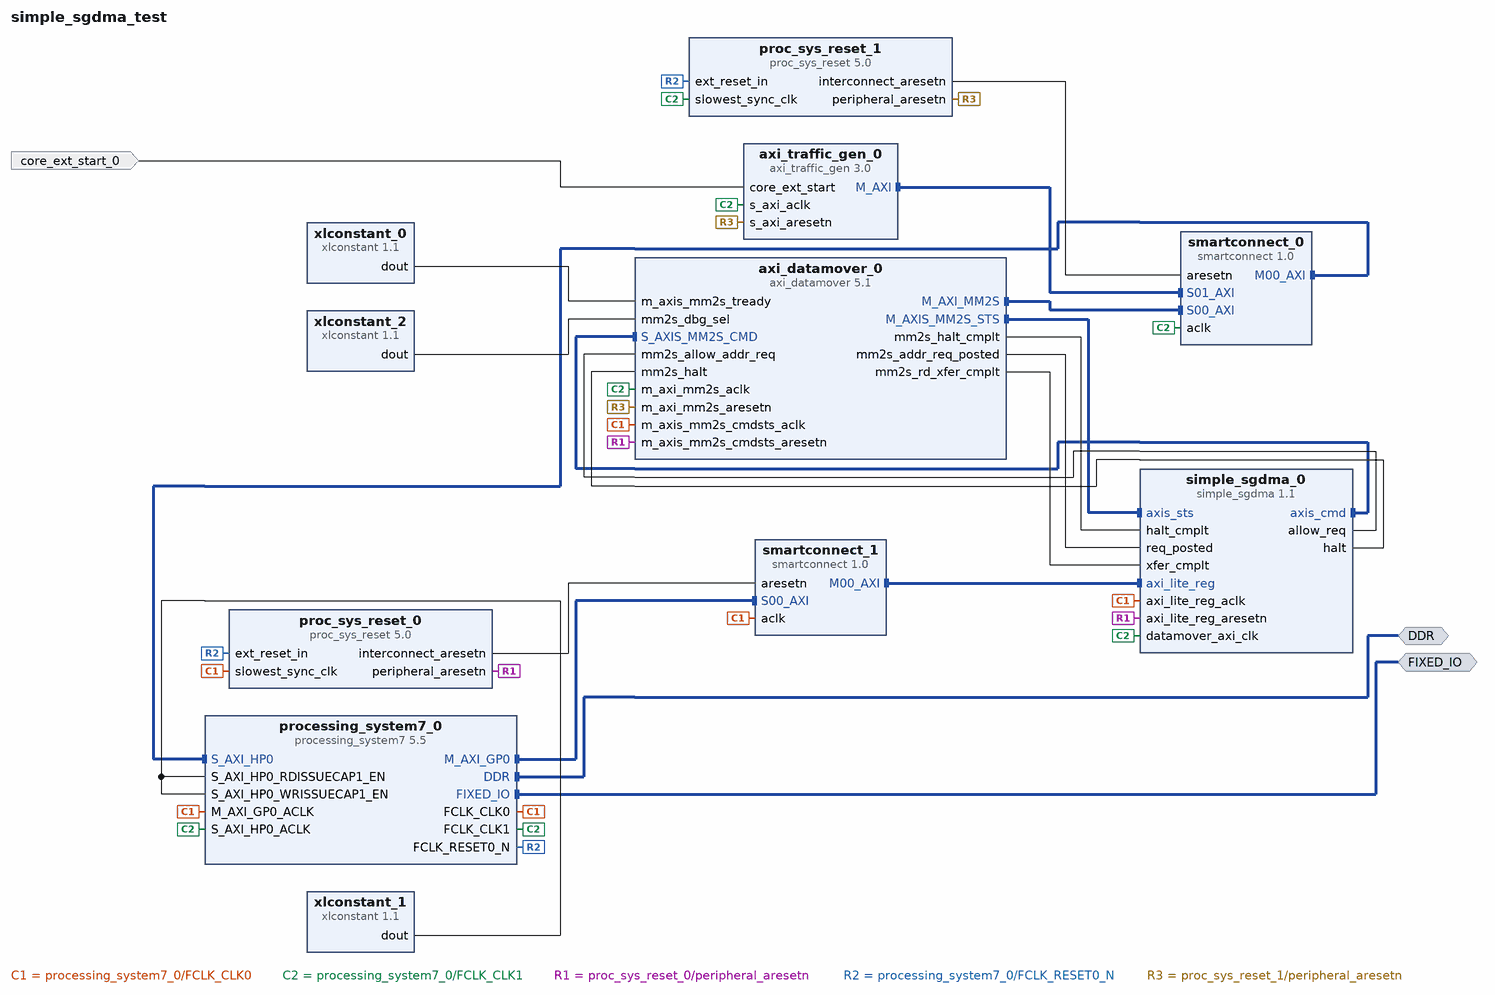
[diagram p0: block diagram of the top level]
# Vivado block design simple_sgdma_test, xc7z010clg400-1, Vivado 2018.1
create_bd_design simple_sgdma_test

create_bd_intf_port -mode Master -vlnv xilinx.com:interface:ddrx_rtl:1.0 DDR
create_bd_intf_port -mode Master -vlnv xilinx.com:display_processing_system7:fixedio_rtl:1.0 FIXED_IO
create_bd_port -dir I core_ext_start_0

create_bd_cell -type ip -vlnv xilinx.com:ip:axi_datamover:5.1 axi_datamover_0
set_property -dict [list \
  CONFIG.c_m_axi_mm2s_data_width 64 \
  CONFIG.c_m_axis_mm2s_tdata_width 64 \
  CONFIG.c_include_mm2s_dre true \
  CONFIG.c_mm2s_burst_size 32 \
  CONFIG.c_mm2s_btt_used 23 \
  CONFIG.c_mm2s_include_sf true \
  CONFIG.c_enable_s2mm 0 \
  CONFIG.c_enable_mm2s_adv_sig 1 \
  CONFIG.c_dummy 1 \
] [get_bd_cells axi_datamover_0]
create_bd_cell -type ip -vlnv xilinx.com:ip:processing_system7:5.5 processing_system7_0
set_property -dict [list \
  CONFIG.PCW_FCLK_CLK1_BUF TRUE \
  CONFIG.PCW_FPGA1_PERIPHERAL_FREQMHZ 150 \
  CONFIG.PCW_USE_S_AXI_HP0 1 \
  CONFIG.PCW_EN_CLK1_PORT 1 \
  CONFIG.PCW_FPGA_FCLK1_ENABLE 1 \
] [get_bd_cells processing_system7_0]
# 30 more settings of processing_system7_0 are not shown: defaults, MIO pin electricals, DDR timing, and values the tool derives
create_bd_cell -type ip -vlnv xilinx.com:ip:smartconnect:1.0 smartconnect_1
set_property -dict {CONFIG.NUM_SI 1} [get_bd_cells smartconnect_1]
create_bd_cell -type ip -vlnv xilinx.com:ip:xlconstant:1.1 xlconstant_0
create_bd_cell -type ip -vlnv xilinx.com:ip:proc_sys_reset:5.0 proc_sys_reset_0
create_bd_cell -type ip -vlnv xilinx.com:ip:proc_sys_reset:5.0 proc_sys_reset_1
create_bd_cell -type ip -vlnv xilinx.com:ip:axi_traffic_gen:3.0 axi_traffic_gen_0
set_property -dict [list \
  CONFIG.TRAFFIC_PROFILE Data \
  CONFIG.DATA_SIZE_AVG 32 \
  CONFIG.DATA_SIZE_MIN 8 \
  CONFIG.DATA_SIZE_MAX 64 \
  CONFIG.DATA_TRAFFIC_PATTERN Random \
  CONFIG.DATA_TRANS_GAP Random \
  CONFIG.DATA_TRANS_TYPE Read_Only \
  CONFIG.DATA_READ_SHARE 100 \
  CONFIG.C_ATG_REPEAT_TYPE One_Shot \
  CONFIG.MASTER_AXI_WIDTH 64 \
  CONFIG.MASTER_HIGH_ADDRESS 0x00000FFF \
  CONFIG.ATG_OPTIONS {High Level Traffic} \
] [get_bd_cells axi_traffic_gen_0]
create_bd_cell -type ip -vlnv xilinx.com:ip:xlconstant:1.1 xlconstant_1
create_bd_cell -type ip -vlnv xilinx.com:ip:smartconnect:1.0 smartconnect_0
create_bd_cell -type ip -vlnv xilinx.com:ip:xlconstant:1.1 xlconstant_2
set_property -dict {CONFIG.CONST_WIDTH 4 CONFIG.CONST_VAL 0} [get_bd_cells xlconstant_2]
create_bd_cell -type ip -vlnv user.org:user:simple_sgdma:1.1 simple_sgdma_0

# ---- connections ----

connect_bd_intf_net [get_bd_intf_pins axi_datamover_0/M_AXIS_MM2S_STS] [get_bd_intf_pins simple_sgdma_0/axis_sts]
connect_bd_intf_net [get_bd_intf_pins axi_datamover_0/S_AXIS_MM2S_CMD] [get_bd_intf_pins simple_sgdma_0/axis_cmd]
connect_bd_intf_net [get_bd_intf_pins processing_system7_0/M_AXI_GP0] [get_bd_intf_pins smartconnect_1/S00_AXI]
connect_bd_intf_net [get_bd_intf_pins smartconnect_1/M00_AXI] [get_bd_intf_pins simple_sgdma_0/axi_lite_reg]
connect_bd_intf_net [get_bd_intf_pins smartconnect_0/M00_AXI] [get_bd_intf_pins processing_system7_0/S_AXI_HP0]
connect_bd_intf_net [get_bd_intf_pins axi_datamover_0/M_AXI_MM2S] [get_bd_intf_pins smartconnect_0/S00_AXI]
connect_bd_intf_net [get_bd_intf_pins axi_traffic_gen_0/M_AXI] [get_bd_intf_pins smartconnect_0/S01_AXI]
connect_bd_intf_net [get_bd_intf_ports DDR] [get_bd_intf_pins processing_system7_0/DDR]
connect_bd_intf_net [get_bd_intf_ports FIXED_IO] [get_bd_intf_pins processing_system7_0/FIXED_IO]
connect_bd_net [get_bd_pins processing_system7_0/FCLK_CLK0] \
  [get_bd_pins axi_datamover_0/m_axis_mm2s_cmdsts_aclk] [get_bd_pins smartconnect_1/aclk] \
  [get_bd_pins processing_system7_0/M_AXI_GP0_ACLK] [get_bd_pins proc_sys_reset_0/slowest_sync_clk] \
  [get_bd_pins simple_sgdma_0/axi_lite_reg_aclk]
connect_bd_net [get_bd_pins processing_system7_0/FCLK_CLK1] \
  [get_bd_pins axi_datamover_0/m_axi_mm2s_aclk] [get_bd_pins processing_system7_0/S_AXI_HP0_ACLK] \
  [get_bd_pins proc_sys_reset_1/slowest_sync_clk] [get_bd_pins axi_traffic_gen_0/s_axi_aclk] \
  [get_bd_pins smartconnect_0/aclk] [get_bd_pins simple_sgdma_0/datamover_axi_clk]
connect_bd_net [get_bd_pins xlconstant_0/dout] [get_bd_pins axi_datamover_0/m_axis_mm2s_tready]
connect_bd_net [get_bd_pins proc_sys_reset_0/interconnect_aresetn] [get_bd_pins smartconnect_1/aresetn]
connect_bd_net [get_bd_pins proc_sys_reset_0/peripheral_aresetn] \
  [get_bd_pins axi_datamover_0/m_axis_mm2s_cmdsts_aresetn] [get_bd_pins simple_sgdma_0/axi_lite_reg_aresetn]
connect_bd_net [get_bd_pins processing_system7_0/FCLK_RESET0_N] \
  [get_bd_pins proc_sys_reset_0/ext_reset_in] [get_bd_pins proc_sys_reset_1/ext_reset_in]
connect_bd_net [get_bd_pins proc_sys_reset_1/peripheral_aresetn] \
  [get_bd_pins axi_datamover_0/m_axi_mm2s_aresetn] [get_bd_pins axi_traffic_gen_0/s_axi_aresetn]
connect_bd_net [get_bd_pins xlconstant_1/dout] \
  [get_bd_pins processing_system7_0/S_AXI_HP0_RDISSUECAP1_EN] [get_bd_pins processing_system7_0/S_AXI_HP0_WRISSUECAP1_EN]
connect_bd_net -net core_ext_start_0_1 [get_bd_ports core_ext_start_0] [get_bd_pins axi_traffic_gen_0/core_ext_start]
connect_bd_net [get_bd_pins proc_sys_reset_1/interconnect_aresetn] [get_bd_pins smartconnect_0/aresetn]
connect_bd_net [get_bd_pins xlconstant_2/dout] [get_bd_pins axi_datamover_0/mm2s_dbg_sel]
connect_bd_net [get_bd_pins simple_sgdma_0/allow_req] [get_bd_pins axi_datamover_0/mm2s_allow_addr_req]
connect_bd_net [get_bd_pins simple_sgdma_0/halt] [get_bd_pins axi_datamover_0/mm2s_halt]
connect_bd_net [get_bd_pins axi_datamover_0/mm2s_halt_cmplt] [get_bd_pins simple_sgdma_0/halt_cmplt]
connect_bd_net [get_bd_pins axi_datamover_0/mm2s_addr_req_posted] [get_bd_pins simple_sgdma_0/req_posted]
connect_bd_net [get_bd_pins axi_datamover_0/mm2s_rd_xfer_cmplt] [get_bd_pins simple_sgdma_0/xfer_cmplt]

# ---- address map ----
assign_bd_address -offset 0x00000000 -range 512M -target_address_space [get_bd_addr_spaces axi_datamover_0/Data_MM2S] [get_bd_addr_segs processing_system7_0/S_AXI_HP0/HP0_DDR_LOWOCM]
assign_bd_address -offset 0x00000000 -range 512M -target_address_space [get_bd_addr_spaces axi_traffic_gen_0/Data] [get_bd_addr_segs processing_system7_0/S_AXI_HP0/HP0_DDR_LOWOCM]
assign_bd_address -offset 0x40500000 -range 64K -target_address_space [get_bd_addr_spaces processing_system7_0/Data] [get_bd_addr_segs simple_sgdma_0/axi_lite_reg/axi_lite_reg_reg]

validate_bd_design
save_bd_design
